# EAGLE schematic T21_MouseSchematic (EAGLE 7.7.0)
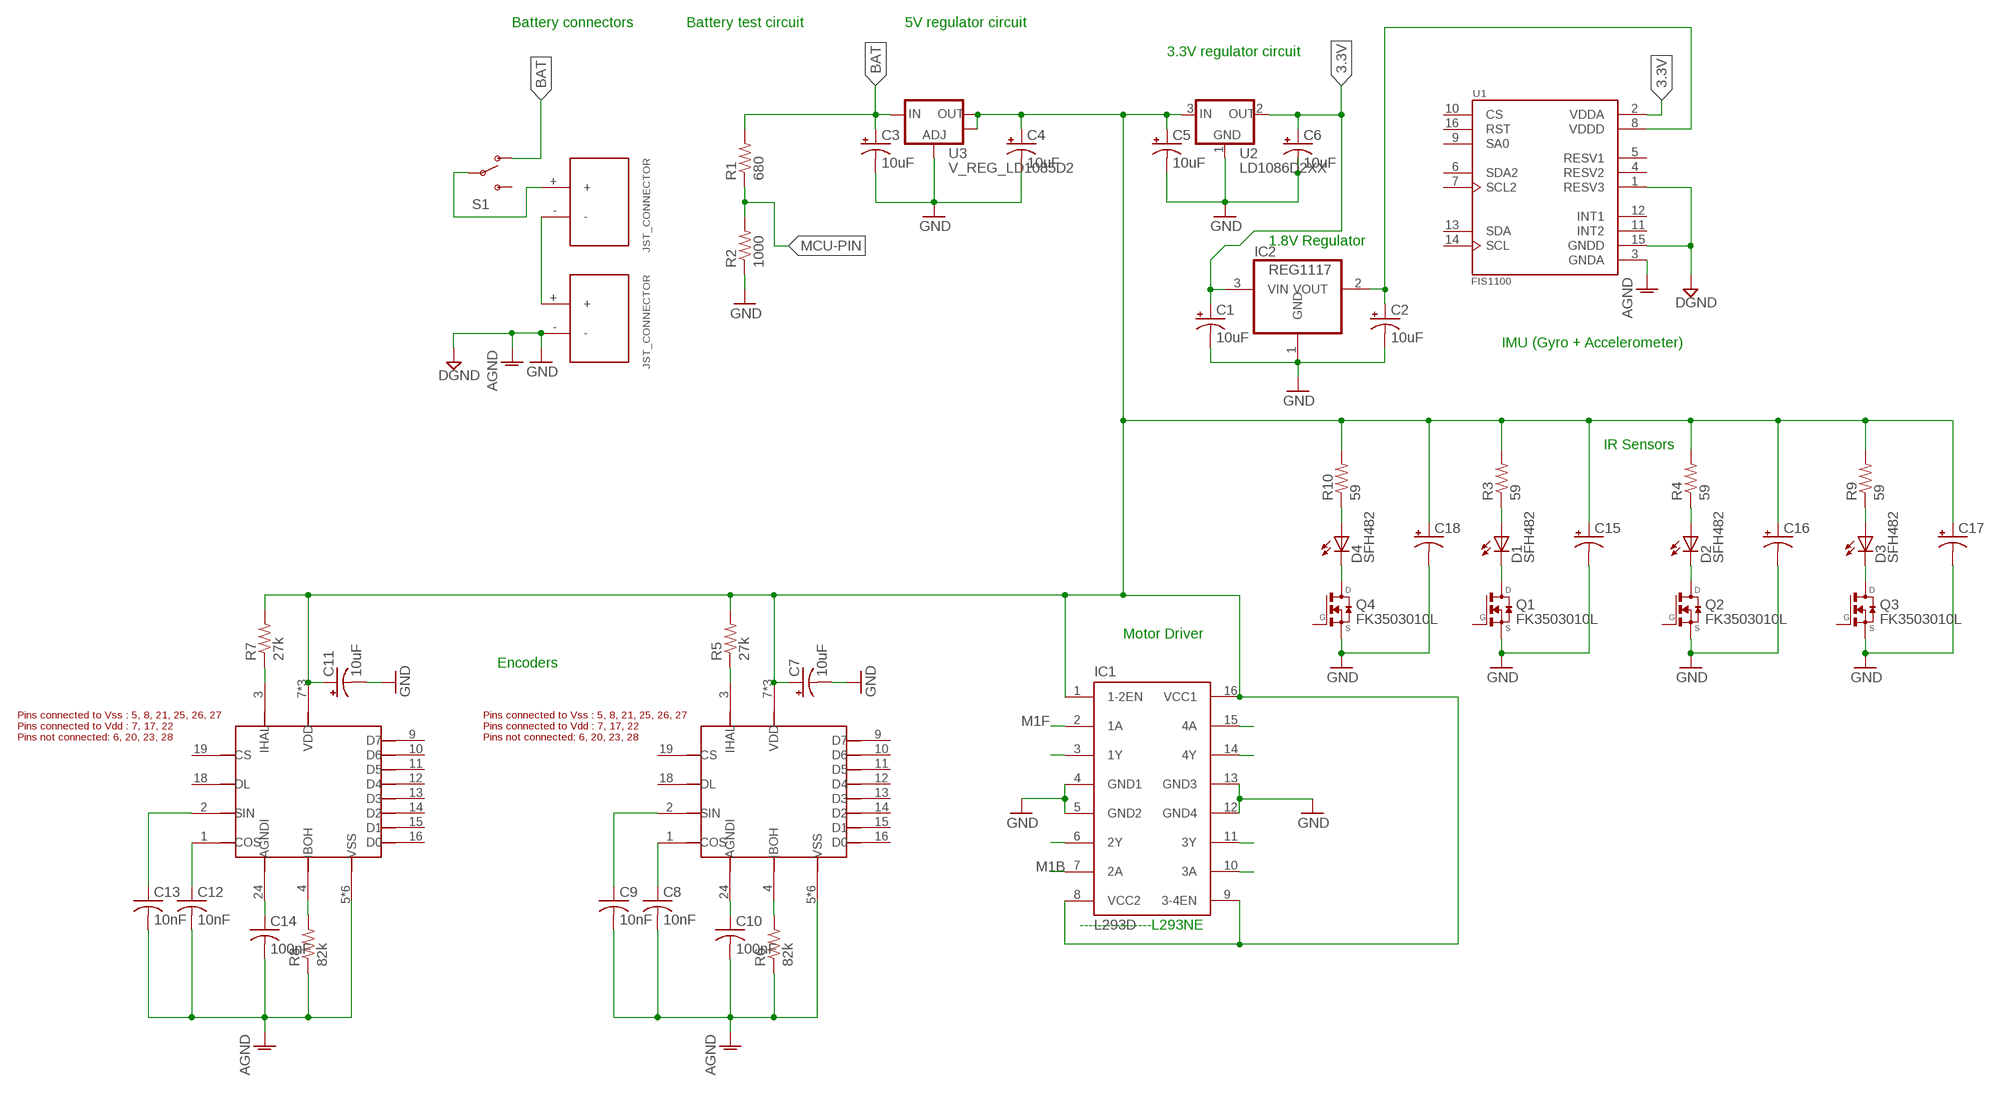
[diagram p0: schematic, sheet 1]

## Parts
C1  10uF  CAP_POLE  [PANASONIC_E]
C2  10uF  CAP_POLE  [PANASONIC_E]
C3  10uF  CAP_POLE  [PANASONIC_E]
C4  10uF  CAP_POLC  [PANASONIC_C]
C5  10uF  CAP_POLE  [PANASONIC_E]
C6  10uF  CAP_POLE  [PANASONIC_E]
C7  10uF  CAP_POLE  [PANASONIC_E]
C8  10nF  C-USC0603  [C0603]
C9  10nF  C-USC0603  [C0603]
C10  100nF  C-USC0603  [C0603]
C11  10uF  CAP_POLE  [PANASONIC_E]
C12  10nF  C-USC0603  [C0603]
C13  10nF  C-USC0603  [C0603]
C14  100nF  C-USC0603  [C0603]
C15  CAP_POLE  [PANASONIC_E]
C16  CAP_POLE  [PANASONIC_E]
C17  CAP_POLE  [PANASONIC_E]
C18  CAP_POLE  [PANASONIC_E]
D1  SFH482  [SFH482]
D2  SFH482  [SFH482]
D3  SFH482  [SFH482]
D4  SFH482  [SFH482]
IC1  L293D  [DIL16]
IC2  REG1117  [SOT223]
Q1  FK3503010L  [SC85]
Q2  FK3503010L  [SC85]
Q3  FK3503010L  [SC85]
Q4  FK3503010L  [SC85]
R1  680  R-US_R0603  [R0603]
R2  1000  R-US_R0603  [R0603]
R3  59  R-US_R0603  [R0603]
R4  59  R-US_R0603  [R0603]
R5  27k  R-US_R0603  [R0603]
R6  82k  R-US_R0603  [R0603]
R7  27k  R-US_R0603  [R0603]
R8  82k  R-US_R0603  [R0603]
R9  59  R-US_R0603  [R0603]
R10  59  R-US_R0603  [R0603]
S1  SWITCH-SPDTPTH  [SWITCH-SPDT]
U1  FIS1100  [LGA16R50P4X4_330X330X100]
U2  LD1086D2XX  [D2PAK]
U3  V_REG_LD1085D2  [D2PACK/A]
U$1  JST_CONNECTOR_FEMALE  [JST_CONNECTOR_FEMALE]
U$2  JST_CONNECTOR_FEMALE  [JST_CONNECTOR_FEMALE]
U$8  AM256  [SSOP28]
U$9  AM256  [SSOP28]

## Nets
3.3V: C1.+ C6.+ IC2.3(VIN) U1.2(VDDA) U2.2(OUT)
5V: C4.+ C5.+ C7.+ C11.+ C15.+ C16.+ C17.+ C18.+ IC1.1(1-2EN) IC1.8(VCC2) IC1.9(3-4EN) IC1.16(VCC1) R3.2 R4.2 R5.2 R7.2 R9.2 R10.2 U2.3(IN) U3.2(OUT) U3.TAB(OUT) U$8.7(VDD) U$8.17(VDD) U$8.22(VDD) U$9.7(VDD) U$9.17(VDD) U$9.22(VDD)
AGND: C8.2 C9.2 C10.2 C12.2 C13.2 C14.2 R6.1 R8.1 U1.3(GNDA) U$8.5(VSS) U$8.8(VSS) U$8.21(VSS) U$8.25(VSS) U$8.26(VSS) U$8.27(VSS) U$9.5(VSS) U$9.8(VSS) U$9.21(VSS) U$9.25(VSS) U$9.26(VSS) U$9.27(VSS)
BAT: C3.+ R1.2 S1.1(O) U3.3(IN)
DGND: U1.1(RESV3) U1.15(GNDD)
GND: C1.- C2.- C3.- C4.- C5.- C6.- C7.- C11.- C15.- C16.- C17.- C18.- IC1.4(GND1) IC1.5(GND2) IC1.12(GND4) IC1.13(GND3) IC2.1(GND) Q1.2(S) Q2.2(S) Q3.2(S) Q4.2(S) R2.1 U2.1(GND) U3.1(ADJ) U$1.- ; supply symbol labelled DGND, AGND
M1B: IC1.7(2A)
M1F: IC1.2(1A)
M2B: IC1.10(3A)
M2F: IC1.15(4A)
MCU-PIN: R1.1 R2.2
N$1: S1.2(P) U$2.+
N$2: U$1.+ U$2.-
N$3: D1.K(C) Q1.3(D)
N$4: C2.+ IC2.2(VOUT) U1.8(VDDD)
N$5: D1.A R3.1
N$7: D2.K(C) Q2.3(D)
N$8: D2.A R4.1
N$9: D3.K(C) Q3.3(D)
N$10: R7.1 U$9.3(IHAL)
N$11: D3.A R9.1
N$12: R5.1 U$8.3(IHAL)
N$13: R6.2 U$8.4(IBOH)
N$14: C8.1 U$8.1(COS)
N$15: C9.1 U$8.2(SIN)
N$16: IC1.6(2Y)
N$17: IC1.3(1Y)
N$18: C10.1 U$8.24(AGNDI)
N$19: R8.2 U$9.4(IBOH)
N$20: C12.1 U$9.1(COS)
N$21: IC1.14(4Y)
N$22: IC1.11(3Y)
N$23: C13.1 U$9.2(SIN)
N$24: C14.1 U$9.24(AGNDI)
N$25: D4.K(C) Q4.3(D)
N$26: D4.A R10.1
Unconnected: Q1.1(G) Q2.1(G) Q3.1(G) Q4.1(G) S1.3(S) U1.6(SDA2) U1.7(SCL2) U1.9(SA0) U1.10(CS) U1.11(INT2) U1.12(INT1) U1.13(SDA) U1.14(SCL) U1.16(RST) U$8.9(D7) U$8.10(D6) U$8.11(D5) U$8.12(D4) U$8.13(D3) U$8.14(D2) U$8.15(D1) U$8.16(D0) U$8.18(DL) U$8.19(CS) U$9.9(D7) U$9.10(D6) U$9.11(D5) U$9.12(D4) U$9.13(D3) U$9.14(D2) U$9.15(D1) U$9.16(D0) U$9.18(DL) U$9.19(CS)

## Notes on the sheet
- Battery connectors | Battery test circuit | 5V regulator circuit
- 3.3V regulator circuit
- 1.8V Regulator
- IMU (Gyro + Accelerometer)
- IR Sensors
- Motor Driver
- Encoders
- ----------------L293NE

## Power pins joined to a net without a drawn wire
RESV1: U1.5(RESV1)
RESV2: U1.4(RESV2)

## Library data of the parts
C1-C7 C11 C15-C18 = SparkFun:CAP_POL: Capacitor Polarized These are standard SMD and PTH capacitors. Normally 10uF, 47uF, and 100uF in electrolytic and tantalum varieties. Always verify the external diameter of the through hole cap, it varies with capacity, voltage, and manufacturer. The EIA devices should be standard.
C8-C10 C12-C14 = resistor:C-US: CAPACITOR, American symbol
D1-D4 = led:SFH482: IR LED infrared emitting diode, Infineon
IC1 = st-microelectronics:L293D: PUSH-PULL 4 CHANNEL DRIVER; MPN: L293D; OC_FARNELL: 9589619; OC_NEWARK: 56P8249
IC2 = burr-brown:REG1117: 800mA and 1A Low Dropout (LDO) Positive Regulator 1.8V, 2.5V, 2.85V, 3.3V, 5V, and Adj; MPN: REG1117; OC_FARNELL: 1097566; OC_NEWARK: 14P6981
Q1-Q4 = transistor-fet:FK3503010L: N-CHANNEL MOSFET
R1 R2 R5-R8 = resistor:R-US_: RESISTOR, American symbol
R3 R4 R9 R10 = rcl:R-US_: RESISTOR, American symbol
S1 = SparkFun-Electromechanical:SWITCH-SPDT: SPDT Switch Simple slide switch, Spark Fun Electronics SKU : COM-00102 DPDT SMT slide switch, AYZ0202, SWCH-08179; PROD_ID: SWCH-08261
U1 = FIS1100:FIS1100: Ic Mems Intertial Measure 16lga; AVAILABILITY: Good; DESCRIPTION: Ic Mems Intertial Measure 16lga; MF: Fairchild Semiconductor; MP: FIS1100; PACKAGE: LGA-16 Fairchild Semiconductor; PRICE: 5.41 USD
U2 = voltage_reg_libraries_MM:LD1086: LDO Regulator LD1086 series
U3 = SparkFun:V_REG_LD1085: LD1085 3A low-drop positive voltage regulator, adjustable The LD1085xx is a low drop voltage regulator able to provide up to 3 A of output current. Dropout is guaranteed at a maximum of 1.2 V at the maximum output current, decreasing at lower loads. The LD1085xx is pin to pin compatible with the older 3-terminal adjustable regulators, but has better performances in term of drop and output tolerance. Available Packages D2PAK/A - 3-pin w/ tabs, SMD
U$1 U$2 = JST_CONNECTOR_FEMALE. through hole:JST_CONNECTOR_FEMALE
U$8 U$9 = rls-am256:AM256